# EAGLE design ThermoBase (EAGLE 9.6.2)
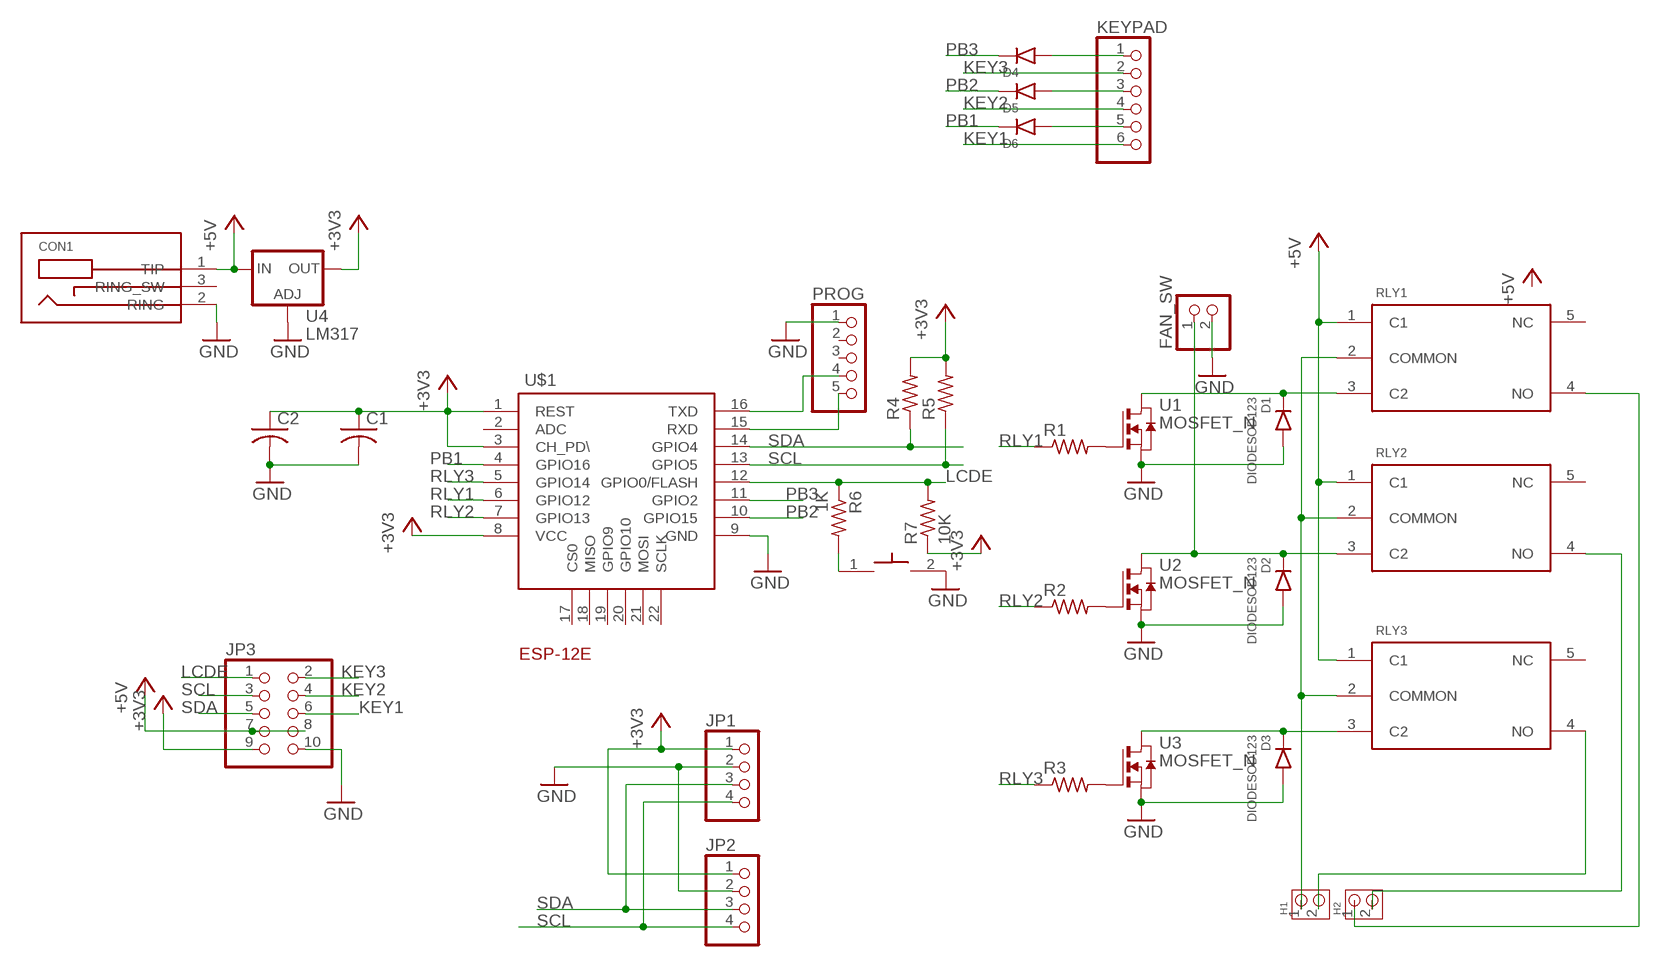
[diagram p0: schematic, sheet 1]

## Parts
BTN1  FSMSM_SWITCH_6X3.6  [SMD-2-SWITCH]
C1  C-USC0805  [C0805]
C2  C-USC0805  [C0805]
CON1  BARREL_JACK_3PINPJ-102A_2MM_HOLES  [PJ-102A_2MM_HOLES]
D1  DIODESOD123  [SOD123]
D2  DIODESOD123  [SOD123]
D3  DIODESOD123  [SOD123]
D4  DIODESOD123  [SOD123]
D5  DIODESOD123  [SOD123]
D6  DIODESOD123  [SOD123]
FAN_SW  PINHD-1X2  [1X02]
H1  TERMBLOCK_5MM_2POS  [TERMBLOCK_5MM_2POS]
H2  TERMBLOCK_5MM_2POS  [TERMBLOCK_5MM_2POS]
JP1  PINHD-1X4  [1X04]
JP2  PINHD-1X4  [1X04]
JP3  PINHD-2X5  [2X05]
KEYPAD  PINHD-1X6  [1X06]
PROG  PINHD-1X5  [1X05]
R1  R-US_R0805  [R0805]
R2  R-US_R0805  [R0805]
R3  R-US_R0805  [R0805]
R4  R-US_R0805  [R0805]
R5  R-US_R0805  [R0805]
R6  1K  R-US_R0805  [R0805]
R7  10K  R-US_R0805  [R0805]
RLY1  RELAY_JQC-3F  [T73_RELAY]
RLY2  RELAY_JQC-3F  [T73_RELAY]
RLY3  RELAY_JQC-3F  [T73_RELAY]
U1  MOSFET_N  [SOT-23]
U2  MOSFET_N  [SOT-23]
U3  MOSFET_N  [SOT-23]
U4  LM317  [SOT223]
U$1  ESP-12E  [ESP-12E]

## Nets
+3V3: C1.1 C2.1 JP1.1 JP2.1 JP3.9 R4.2 R5.2 R7.1 U4.2(OUT) U4.4(OUT) U$1.1(REST) U$1.3(CH_PD\) U$1.8(VCC)
+5V: CON1.1(TIP) JP3.7 JP3.8 RLY1.1(C1) RLY2.1(C1) RLY3.1(C1) U4.3(IN)
GND: BTN1.2 C1.2 C2.2 CON1.2(RING) D1.1(A) D2.1(A) D3.1(A) FAN_SW.2 JP1.2 JP2.2 JP3.10 PROG.1 U1.2(S) U2.2(S) U3.2(S) U4.1(ADJ) U$1.9(GND)
KEY1: JP3.6 KEYPAD.6
KEY2: JP3.4 KEYPAD.4
KEY3: JP3.2 KEYPAD.2
LCDE: JP3.1 R6.1 R7.2 U$1.12(GPIO0/FLASH)
N$1: PROG.5 U$1.15(RXD)
N$2: PROG.4 U$1.16(TXD)
N$3: H2.1 RLY1.4(NO)
N$4: R1.2 U1.1(G)
N$5: R2.2 U2.1(G)
N$6: R3.2 U3.1(G)
N$7: D1.2(C) RLY1.3(C2) U1.3(D)
N$8: H2.2 RLY2.4(NO)
N$9: D2.2(C) FAN_SW.1 RLY2.3(C2) U2.3(D)
N$10: D3.2(C) RLY3.3(C2) U3.3(D)
N$11: H1.1 RLY1.2(COMMON) RLY2.2(COMMON) RLY3.2(COMMON)
N$12: H1.2 RLY3.4(NO)
N$13: D4.1(A) KEYPAD.1
N$14: D5.1(A) KEYPAD.3
N$15: D6.1(A) KEYPAD.5
N$16: BTN1.1 R6.2
PB1: D6.2(C) U$1.4(GPIO16)
PB2: D5.2(C) U$1.10(GPIO15)
PB3: D4.2(C) U$1.11(GPIO2)
RLY1: R1.1 U$1.6(GPIO12)
RLY2: R2.1 U$1.7(GPIO13)
RLY3: R3.1 U$1.5(GPIO14)
SCL: JP1.4 JP2.4 JP3.3 R5.1 U$1.13(GPIO5)
SDA: JP1.3 JP2.3 JP3.5 R4.1 U$1.14(GPIO4)
Unconnected: CON1.3(RING_SW) PROG.2 PROG.3 RLY1.5(NC) RLY2.5(NC) RLY3.5(NC) U$1.2(ADC) U$1.17(CS0) U$1.18(MISO) U$1.19(GPIO9) U$1.20(GPIO10) U$1.21(MOSI) U$1.22(SCLK)

## Library data of the parts
BTN1 = DR:FSMSM_SWITCH_6X3.6: SMD SWITCH - Single Contact
C1 C2 = DR:C-US: CAPACITOR, American symbol
CON1 = DR:BARREL_JACK_3PIN
D1-D6 = DR:DIODE
FAN_SW = pinhead:PINHD-1X2: PIN HEADER
H1 H2 = DR:TERMBLOCK_5MM_2POS
JP1 JP2 = pinhead:PINHD-1X4: PIN HEADER
JP3 = pinhead:PINHD-2X5: PIN HEADER
KEYPAD = pinhead:PINHD-1X6: PIN HEADER
PROG = pinhead:PINHD-1X5: PIN HEADER
R1-R7 = DR:R-US_: RESISTOR, American symbol
RLY1-RLY3 = DR:RELAY_JQC-3F
U1-U3 = DR:MOSFET_N
U4 = DR:LM317: Voltage Regulator
U$1 = DR:ESP-12E

## Board
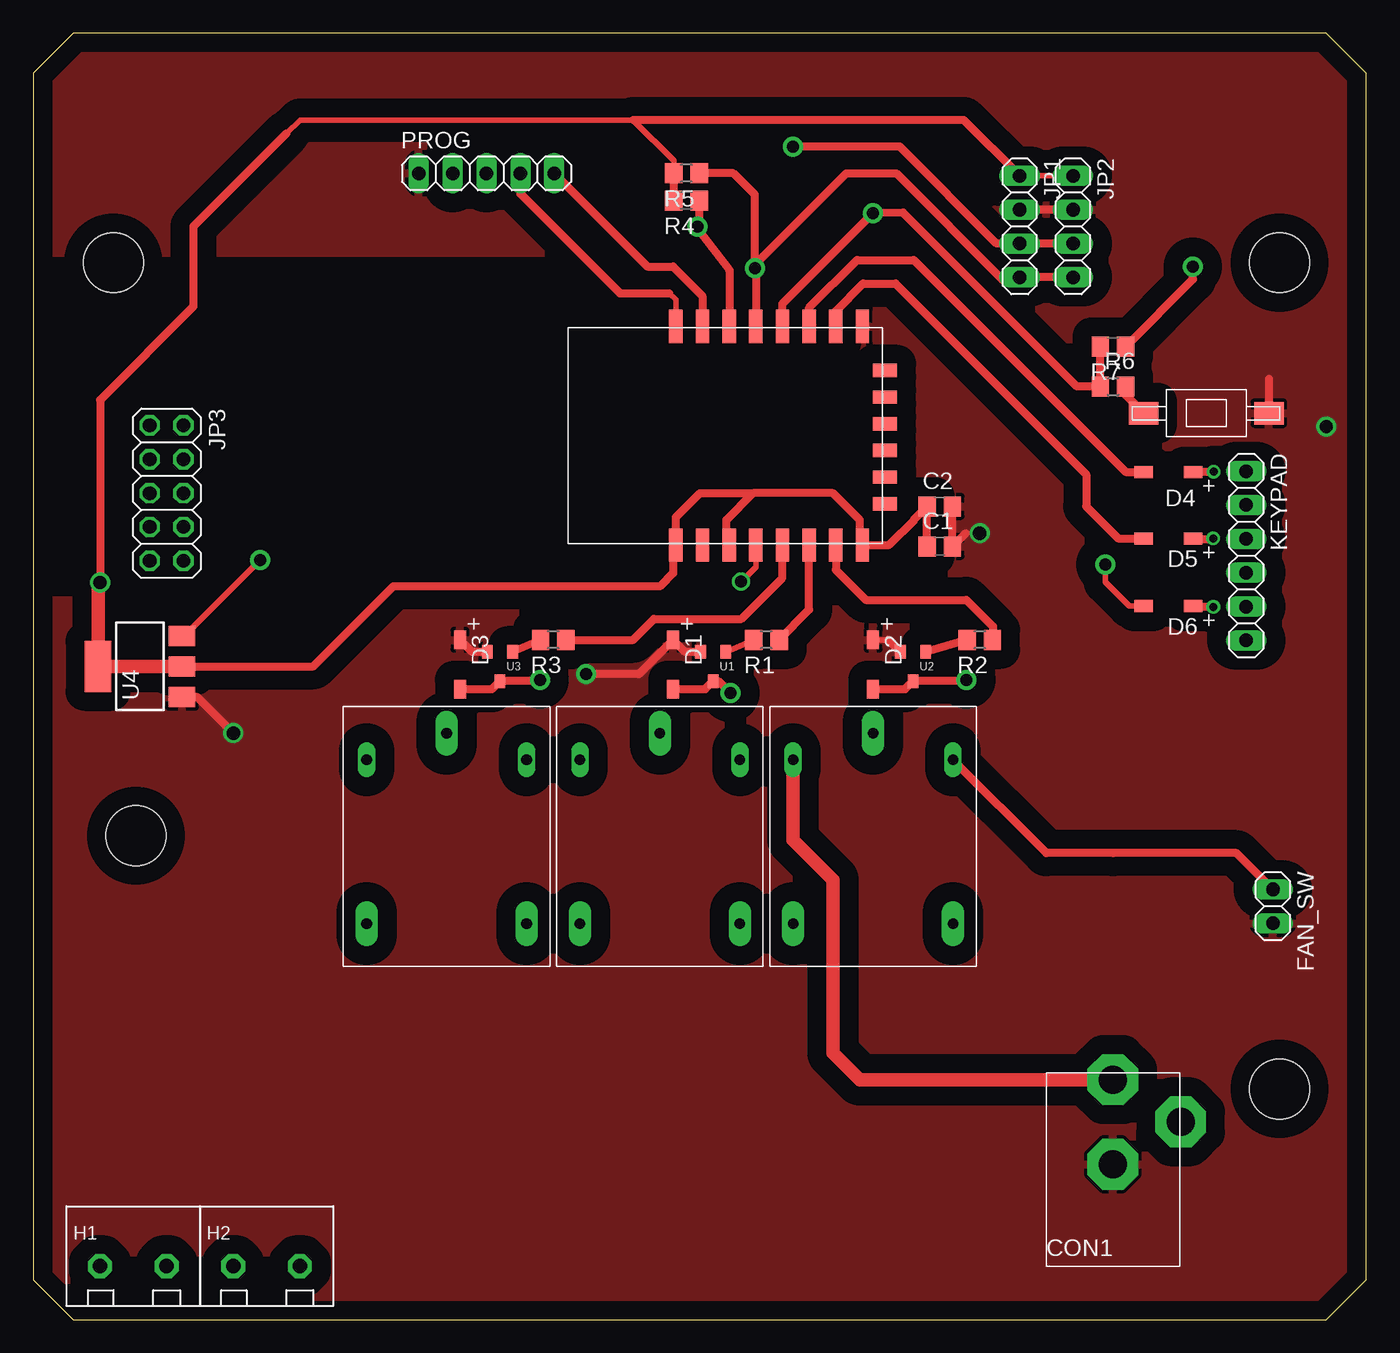
[diagram p1: board, top side]
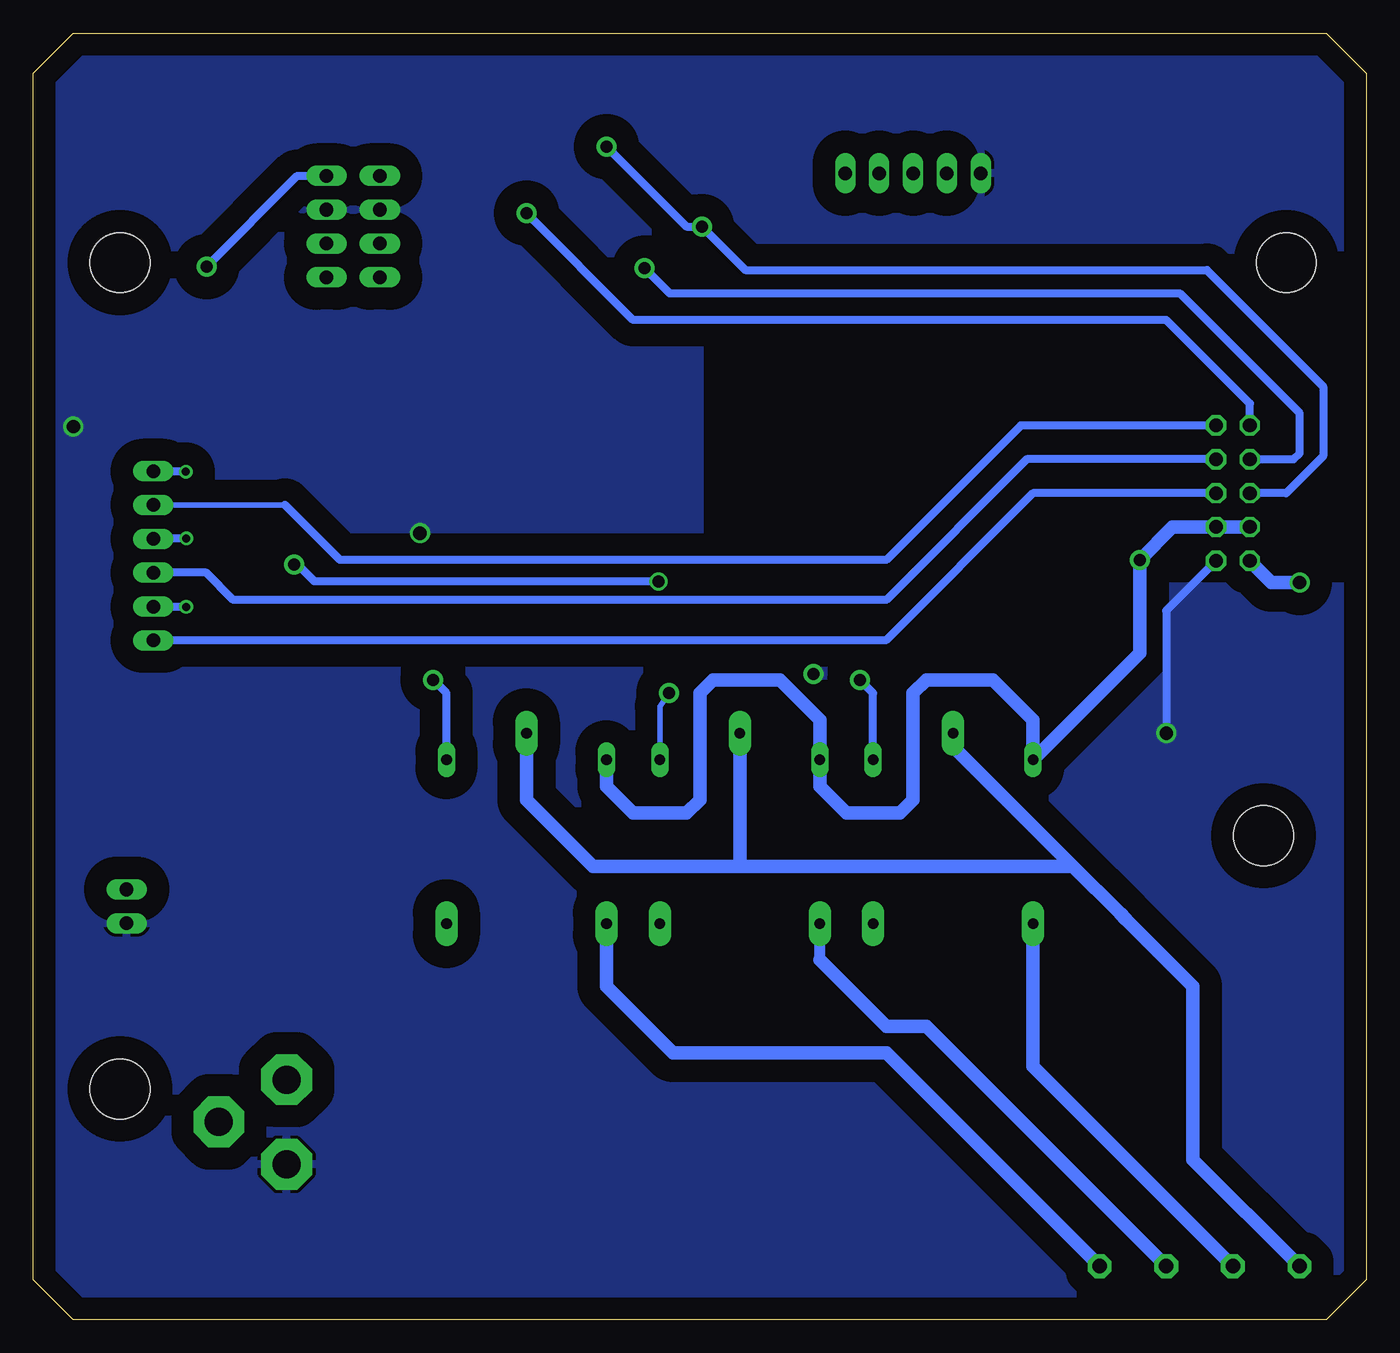
[diagram p2: board, bottom side, seen from below]

Size 100 x 96.5 mm. Coordinates in mm from the lower left corner, seen from the top.
Outline: 0,3 3,0 97,0 100,3 100,93.5 97,96.5 3,96.5 0,93.5 0,3
Copper layers (1*16): Top 0.035mm / dielectric 1.5mm / Bottom 0.035mm
Design rules "default": minimum track width 10mil, minimum drill 24mil, track to track 8mil, track to pad 8mil, pad to pad 8mil, via to via 8mil, smd to smd 8mil, copper to edge 40mil, drill to drill 8mil, minimum pad ring 10mil, minimum via ring 8mil, stop-mask expansion 4mil, vias tented up to drill 0mil, thermal gap 10mil
Holes 4.5 mm at 93.5,17.3 93.5,79.3 7.7,36.3 6,79.3

### Footprints (pad centres in the part's own frame; a part is rotated, then mirrored left to right if it is on the bottom)
SMD-2-SWITCH = smd 2.2 x 1.7: 1 -4.7,0; 2 4.7,0
C0805 = smd 1.3 x 1.5: 1 -0.95,0; 2 0.95,0
PJ-102A_2MM_HOLES = drill 2.1 pad 3.81 octagon: 1 0,0; 2 0,6.35; 3 -5.08,3.175
SOD123 = smd 1.4 x 0.9: 1 0,0; 2 3.7,0
1X02 = drill 1.016 long: 1 -1.27,0; 2 1.27,0
TERMBLOCK_5MM_2POS = drill 1.1 pad 1.778 octagon: 1 0,0; 2 5,0
1X04 = drill 1.016 long: 1 -3.81,0; 2 -1.27,0; 3 1.27,0; 4 3.81,0
2X05 = drill 1.016 octagon: 1 -5.08,-1.27; 2 -5.08,1.27; 3 -2.54,-1.27; 4 -2.54,1.27; 5 0,-1.27; 6 0,1.27; 7 2.54,-1.27; 8 2.54,1.27; 9 5.08,-1.27; 10 5.08,1.27
1X06 = drill 1.016 long: 1 -6.35,0; 2 -3.81,0; 3 -1.27,0; 4 1.27,0; 5 3.81,0; 6 6.35,0
1X05 = drill 1.016 long: 1 -5.08,0; 2 -2.54,0; 3 0,0; 4 2.54,0; 5 5.08,0
R0805 = smd 1.3 x 1.5: 1 -0.95,0; 2 0.95,0
T73_RELAY = drill 0.8 long: 1 2,0; 3 2,12 | drill 0.8 pad 1.676 long: 2 0,6; 4 14.3,0; 5 14.3,12
SOT-23 = smd 0.8 x 1: 1 -0.95,-2.1; 2 0.95,-2.1; 3 0,0.1
SOT223 = smd 1.5 x 2: 1 -2.3,-3.15; 2 0,-3.15; 3 2.3,-3.15 | smd 3.8 x 2: 4 0,3.15
ESP-12E = smd 2.5 x 1: 1 -0.1,14; 2 -0.1,12; 3 -0.1,10; 4 -0.1,8; 5 -0.1,6; 6 -0.1,4; 7 -0.1,2; 8 -0.1,0; 9 16.3,0; 10 16.3,2; 11 16.3,4; 12 16.3,6; 13 16.3,8; 14 16.3,10; 15 16.3,12; 16 16.3,14 | smd 1 x 1.8: 17 3,-1.7; 18 5,-1.7; 19 7,-1.7; 20 9,-1.7; 21 11,-1.7; 22 13,-1.7

### Placement (x,y rotation side)
BTN1  88,68 0 top
C1  68,58 0 top
C2  68,61 0 top
CON1  81,18 180 top
D1  48,51 270 top
D2  63,51 270 top
D3  32,51 270 top
D4  87,63.6 180 top
D5  87,58.6 180 top
D6  87,53.52 180 top
FAN_SW  93,31 270 top
H1  5,4 0 top
H2  15,4 0 top
JP1  74,82 270 top
JP2  78,82 270 top
JP3  10,62 270 top
KEYPAD  91,57.3 270 top
PROG  34,86 0 top
R1  55,51 180 top
R2  71,51 180 top
R3  39,51 180 top
R4  49,83.95 180 top
R5  49,86 180 top
R6  81,70 0 top
R7  81,73 180 top
RLY1  41,44 270 top
RLY2  57,44 270 top
RLY3  25,44 270 top
U1  51,48 180 top
U2  66,48 180 top
U3  35,48 180 top
U4  8,49 90 top
U$1  62.2,58.21 90 top

### Tracks (layer width: path | path; a pad name or v marks a point on that pad's centre or on a via)
+3V3  (via drill 0.9 pad 1.5, 1 pad 1.2)
  Top 0.406: U$1.8 62,58.31 | 66.1,60 66.09,60.04 | U$1.3 52,58.31 | 19,89 20,90 45,90 48.05,86.95 R5.2 | JP1.1 JP2.1
  Top 0.61: 62,58.31 62,60 60,62 54,62 | 54,62 52,60 52,58.31 | 66.1,60 64.2,58.11 U$1.8 | 66.09,60.04 C2.1 C1.1 | 54,62 50,62 48.2,60.2 U$1.1 48,57.9 48,56 47,55 27,55 21,49 U4.2 | 19,89 12,82 12,76 5,69 5,55.54 | R4.2 R5.2 | JP1.1 69.81,90 45,90 | R7.1 87,78.05 v87,79
  Top 1.016: U4.2 U4.4 4.85,55.39 5,55.54 v5,55.3
  Bottom 0.61: v87,79 80.19,85.81 JP2.1
  Bottom 1.016: v5,55.3 7.11,55.3 JP3.9
+5V  (via drill 0.9 pad 1.5)
  Top 0.406: U4.3 11.3,51.3 v17,57
  Top 1.016: RLY2.1 57,36 60,33 60,20 62,18 CON1.1
  Bottom 1.016: RLY2.1 57,40 55,38 51,38 50,39 50,47 49,48 44,48 41,45 RLY1.1 41,40 39,38 35,38 34,39 34,47 33,48 28,48 25,45 RLY3.1 17,50 v17,57 14.54,59.46 JP3.8 JP3.7
GND  (via drill 0.9 pad 1.5, 1 pad 1.2)
  Top 0.254: 69.95,59 v71,59
  Top 0.406: D2.1 64.15,51
  Top 0.61: U1.2 48.9,50.1 D1.1 45.43,48.43 v41.46,48.43 | U3.2 32.9,50.1 D3.1 | v15,44 12.3,46.7 U4.1 | 64.15,51 U2.2 | 69.95,59 C1.2 C2.2 | JP2.2 JP1.2 | 92.7,70.57 BTN1.2
  Bottom 0.61: JP3.10 15,53.19 v15,44
  other vias: 97,67
  pour Top (isolate 1.422): -1,98 102,98 103,97 103,99 105,97 105,-2 102,-5 -5,-5 -5,54 48,54 49,55 49,79 48,80 -3,80 -3,98
  pour Bottom (isolate 1.676): -3,79 -3,98 -2,99 103,99 105,97 105,-1 101,-5 -1,-5 -4,-2 -4,55 51,55 50,56 50,77 -1,77
KEY1
  Bottom 0.61: JP3.6 25,62 36.05,50.95 KEYPAD.6
KEY2
  Bottom 0.61: JP3.4 25.46,64.54 36,54 85,54 87.03,56.03 KEYPAD.4
KEY3
  Bottom 0.406: 81.11,61.11 KEYPAD.2
  Bottom 0.61: JP3.2 25.92,67.08 36,57 77,57 81.11,61.11
LCDE  (via drill 0.9 pad 1.5)
  Top 0.61: U$1.12 56.2,76.2 v63,83 65.25,83.05 78.3,70 R6.1 R7.2
  Bottom 0.61: JP3.1 8.73,68.73 15,75 55,75 v63,83
N$1
  Top 0.61: PROG.5 46.08,79 48,79 50.2,76.8 U$1.15
N$2
  Top 0.406: U$1.16 48.2,76.51 47.71,77
  Top 0.61: PROG.4 36.54,84.46 44,77 47.71,77
N$3
  Bottom 0.813: 41,27 RLY1.4
  Bottom 1.016: H2.1 33,22 36,22 41,27
N$4
  Top 0.406: R1.2 U1.1
N$5
  Top 0.61: R2.2 U2.1
N$6
  Top 0.61: R3.2 U3.1
N$7  (via drill 0.9 pad 1.5)
  Top 0.61: D1.2 50.4,47.3 U1.3 51.4,47.9 v52.3,47
  Bottom 0.406: v52.3,47 53,46 RLY1.3
N$8
  Bottom 1.016: H2.2 36,20 52,20 57,25 RLY2.4
N$9  (via drill 0.9 pad 1.5)
  Top 0.406: v70,48 69.9,47.9
  Top 0.61: D2.2 65.4,47.3 U2.3 69.9,47.9 | RLY2.3 76,35 81,35 90.27,35 FAN_SW.1
  Bottom 0.61: RLY2.3 69,47 v70,48
N$10  (via drill 0.9 pad 1.5)
  Top 0.406: v38,48 37.9,47.9
  Top 0.61: D3.2 34.4,47.3 U3.3 37.9,47.9
  Bottom 0.61: RLY3.3 37,47 v38,48
N$11
  Bottom 1.016: RLY3.2 31,43 22,34 | 22,34 18.5,30.5 18,30 13,25 13,12 H1.1 | RLY2.2 63,39 58,34 47,34 | 47,34 22,34 | RLY1.2 47,34
N$12
  Bottom 1.016: H1.2 25,19 RLY3.4
N$13  (via drill 0.61)
  Top 0.61: D4.1 87.26,63.61 v88.56,63.61
  Bottom 0.61: v88.56,63.61 90.96,63.61 KEYPAD.1
N$14  (via drill 0.61)
  Top 0.254: D5.1 87.28,58.57
  Top 0.61: 87.28,58.57 88.5,58.57 v88.53,58.6
  Bottom 0.61: v88.53,58.6 90.97,58.6 KEYPAD.3
N$15  (via drill 0.61)
  Top 0.61: v88.53,53.47 87.3,53.47 D6.1
  Bottom 0.61: KEYPAD.5 88.56,53.49 v88.53,53.47
N$16
  Top 0.61: BTN1.1 81.95,69.35 R6.2
PB1  (via drill 0.9 pad 1, 0.9 pad 1.5)
  Top 0.406: U$1.4 54.2,56.45 53.12,55.37 v53.1,55.38 | v80.43,56.64 80.43,55.33 82.25,53.52 D6.2
  Bottom 0.61: v53.1,55.38 78.91,55.38 80.17,56.64 v80.43,56.64
PB2
  Top 0.406: U$1.10 60.2,75.67
  Top 0.61: 60.2,75.67 62.25,77.72 64.69,77.72 79,63.41 79,61 81.4,58.6 D5.2
PB3
  Top 0.61: U$1.11 58.2,75.91 61.8,79.5 66.06,79.5 81.97,63.6 D4.2
RLY1
  Top 0.61: R1.1 58.2,53.26 U$1.6
RLY2
  Top 0.61: R2.1 72,51.05 72,52 70,54 62.45,54 60.2,56.24 U$1.7
RLY3
  Top 0.61: R3.1 45,51 46.56,52.56 53.12,52.56 56.2,55.65 U$1.5
SCL  (via drill 0.9 pad 1.5)
  Top 0.406: v54.13,78.87 54.13,79.13 | 72.74,78 73.81,78 JP1.4
  Top 0.61: R5.1 52.52,86 54.13,84.4 v54.13,78.87 54.2,78.8 U$1.13 | JP2.4 JP1.4 | 54.13,79.13 61,86 64.74,86 72.74,78
  Bottom 0.61: JP3.3 5.46,64.54 5,65 5,68 14,77 52.25,77 v54.13,78.87
SDA  (via drill 0.9 pad 1.5)
  Top 0.406: 49.95,82 49.95,81.7
  Top 0.61: U$1.14 52.23,74.53 52.23,78.72 52.25,78.73 49.95,81.7 | R4.1 49.95,82 v49.84,82 | v57,88 65,88 72.27,80.73 JP1.3 JP2.3
  Bottom 0.61: JP3.5 6,62 3.22,64.78 3.22,70 11.96,78.74 46.58,78.74 v49.84,82 51,82 v57,88

### Text on the board
Reference: ESP12 Thermo Board / V1.0 6/6/25